# EAGLE design interstage_B1v2 (EAGLE 9.2.2)
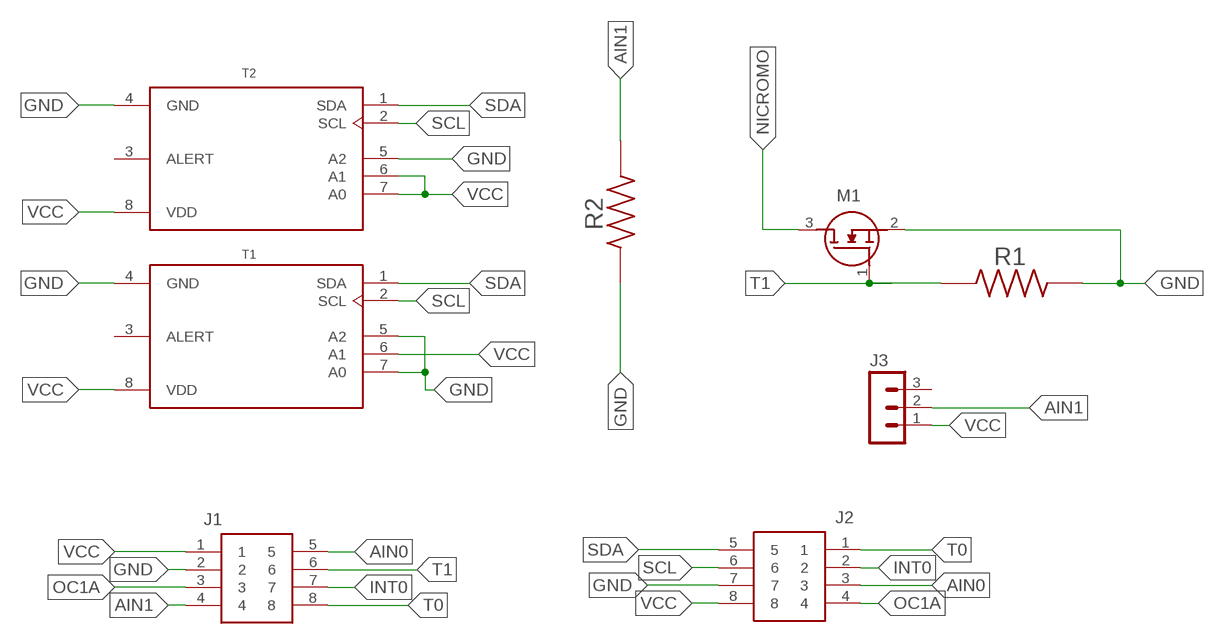
[diagram p0: schematic, sheet 1]

## Parts
J1  53261-0871  [53261-0871]
J2  53261-0871  [53261-0871]
J3  MA03-1  [MA03-1]
M1  PMV16XNR  [SOT95P230X110-3N]
R1  330  ERA-8AEB331V  [RESC3216X70N]
R2  330  ERA-8AEB331V  [RESC3216X70N]
T1  MCP9808T-E/MS  [SOP65P490X110-8N]
T2  MCP9808T-E/MS  [SOP65P490X110-8N]

## Nets
AIN0: J1.5 J2.3
AIN1: J1.4 J3.2 R2.2
GND: J1.2 J2.7 M1.2(S) R1.2 R2.1 T1.4(GND) T1.5(A2) T1.7(A0) T2.4(GND) T2.5(A2)
INT0: J1.7 J2.2
NICROMO: M1.3(D)
OC1A: J1.3 J2.4
SCL: J2.6 T1.2(SCL) T2.2(SCL)
SDA: J2.5 T1.1(SDA) T2.1(SDA)
T0: J1.8 J2.1
T1: J1.6 M1.1(G) R1.1
VCC: J1.1 J2.8 J3.1 T1.6(A1) T1.8(VDD) T2.6(A1) T2.7(A0) T2.8(VDD)
Unconnected: J3.3 T1.3(ALERT) T2.3(ALERT)

## Library data of the parts
J1 J2 = SamacSys_Parts:53261-0871: Molex PICOBLADE Series, Series Number 53261, 1.25mm Pitch, 8 Way 1 Row Shrouded Right Angle PCB Header, Surface Mount Source: Datasheet <http://www.molex.com/webdocs/datasheets/pdf/en-us/0532610871_PCB_HEADERS.pdf>; DESCRIPTION: Molex PICOBLADE Series, Series Number 53261, 1.25mm Pitch, 8 Way 1 Row Shrouded Right Angle PCB Header, Surface Mount; HEIGHT: mm; MANUFACTURER_NAME: Molex; MANUFACTURER_PART_NUMBER: 53261-0871; MOUSER_PART_NUMBER: 538-53261-0871; MOUSER_PRICE-STOCK: https://www.mouser.co.uk/ProductDetail/Molex/53261-0871?qs=%252B72YyncTwW%252BggfdCJ7Netw%3D%3D
J3 = con-lstb:MA03-1: PIN HEADER; OC_FARNELL: unknown; OC_NEWARK: unknown
M1 = SamacSys_Parts:PMV16XNR: Nexperia PMV16XNR N-channel MOSFET, 8.6 A, 20 V PMV16XN, 3-Pin SOT-23 Source: Datasheet <https://componentsearchengine.com/Datasheets/1/PMV16XNR.pdf>; DESCRIPTION: Nexperia PMV16XNR N-channel MOSFET, 8.6 A, 20 V PMV16XN, 3-Pin SOT-23; HEIGHT: 1.1mm; MANUFACTURER_NAME: Nexperia; MANUFACTURER_PART_NUMBER: PMV16XNR; MOUSER_PART_NUMBER: 771-PMV16XNR; MOUSER_PRICE-STOCK: https://www.mouser.com/Search/Refine.aspx?Keyword=771-PMV16XNR
R1 R2 = resistor_330_smd:ERA-8AEB331V; DESCRIPTION: 330 Ohms ±0.1% 0.25W, 1/4W Chip Resistor 1206 (3216 Metric) Automotive AEC-Q200 Thin Film; DIGI-KEY_PART_NUMBER: P330BCCT-ND; MF: Panasonic Electronic; MP: ERA-8AEB331V; PACKAGE: 3216 Panasonic Electronic Components
T1 T2 = sensorSPEL:MCP9808T-E/MS: Board Mount Temperature Sensors Silicon temp sensor with I2C interface; DESCRIPTION: Temperature Sensor Digital, Local -40°C ~ 125°C 10 b 8-MSOP; DIGI-KEY_PART_NUMBER: MCP9808T-E/MSCT-ND; MF: Microchip; MP: MCP9808T-E/MS; PACKAGE: MSOP-8 Microchip

## Board
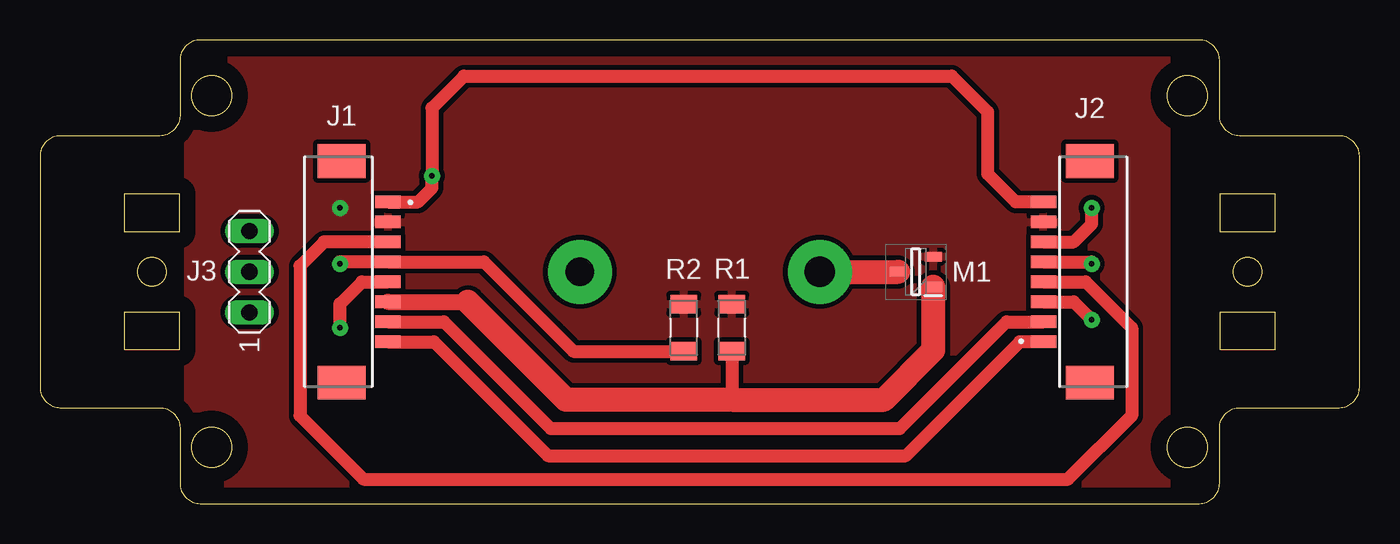
[diagram p1: board, top side]
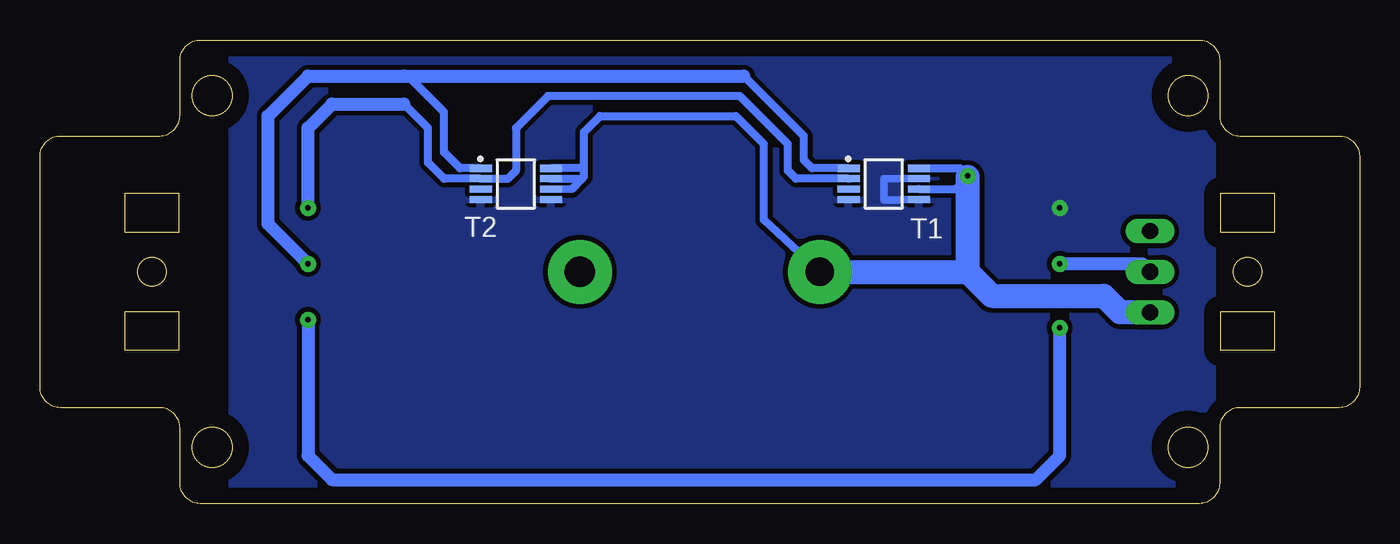
[diagram p2: board, bottom side, seen from below]

Size 82.5 x 29 mm. Coordinates in mm from the lower left corner, seen from the top.
Outline: 5.3,17 5.3,19.4 8.7,19.4 8.7,17 5.3,17
Outline: 73.8,9.6 73.8,12 77.2,12 77.2,9.6 73.8,9.6
Outline: 5.3,12 8.7,12 8.7,9.6 5.3,9.6 5.3,12
Outline: 73.8,17 73.8,19.4 77.2,19.4 77.2,17 73.8,17
Outline: 1.27,6 7.48,6 arc-90 8.75,4.73 8.75,1.27 arc90 10.02,0 72.48,0 arc90 73.75,1.27 73.75,4.73 arc-90 75.02,6 81.23,6 arc90 82.5,7.27 82.5,21.73 arc90 81.23,23 75.02,23 arc-90 73.75,24.27 73.75,27.73 arc90 72.48,29 10.02,29 arc90 8.75,27.73 8.75,24.27 arc-90 7.48,23 1.27,23 arc90 0,21.73 0,7.27 arc90 1.27,6
Outline: circle at 7,14.5 radius 0.9
Outline: circle at 75.5,14.5 radius 0.9
Outline: circle at 10.72,25.52 radius 1.25
Outline: circle at 71.72,3.52 radius 1.25
Outline: circle at 71.72,25.52 radius 1.25
Outline: circle at 10.72,3.52 radius 1.25
Copper layers (1*16): Top 0.035mm / dielectric 1.5mm / Bottom 0.035mm
Design rules "default *": minimum track width 6mil, minimum drill 0.35mm, track to track 0.3mm, track to pad 6mil, pad to pad 6mil, via to via 6mil, smd to smd 6mil, copper to edge 40mil, drill to drill 6mil, minimum pad ring 10mil, minimum via ring 8mil, stop-mask expansion 4mil, vias tented up to drill 0mil, thermal gap 10mil

### Footprints (pad centres in the part's own frame; a part is rotated, then mirrored left to right if it is on the bottom)
53261-0871 = smd 0.8 x 1.6: 1 -4.375,1.004; 2 -3.125,1.004; 3 -1.875,1.004; 4 -0.625,1.004; 5 0.625,1.004; 6 1.875,1.004; 7 3.125,1.004; 8 4.375,1.004 | smd 2.1 x 3: 9 6.925,-1.896; 10 -6.925,-1.896
MA03-1 = drill 1.016 long: 1 -2.54,0; 2 0,0; 3 2.54,0
SOT95P230X110-3N = smd 1.05 x 0.6: 1 -1.1,0.95; 2 -1.1,-0.95; 3 1.1,0
RESC3216X70N = smd 1.16 x 1.68: 1 -1.475,0; 2 1.475,0
SOP65P490X110-8N = smd 1.4 x 0.45: 1 -2.2,0.975; 2 -2.2,0.325; 3 -2.2,-0.325; 4 -2.2,-0.975; 5 2.2,-0.975; 6 2.2,-0.325; 7 2.2,0.325; 8 2.2,0.975

### Placement (x,y rotation side)
J1  20.75,14.5 270 top
J2  63.75,14.5 90 top
J3  13.1,14.5 90 top
M1  54.75,14.5 180 top
R1  43.25,11 90 top
R2  40.25,11 270 top
T1  29.75,20 0 bottom
T2  52.75,20 0 bottom

### Tracks (layer width: path | path; a pad name or v marks a point on that pad's centre or on a via)
AIN0  (via drill 0.35 pad 1)
  Top 0.8: v18.75,11 18.75,12.5 20.12,13.88 J1.5 | v65.75,11.5 64.62,12.62 J2.3
  Bottom 0.8: v65.75,11.5 65.75,3 64.25,1.5 20.25,1.5 18.75,3 v18.75,11
AIN1  (via drill 0.35 pad 1)
  Top 0.5: 18.75,15.12 v18.75,15
  Top 0.8: 18.75,15.12 J1.4 27.75,15.12 33.35,9.53 R2.2
  Bottom 0.8: v18.75,15 13.6,15 J3.2
GND  (via drill 0.35 pad 1)
  Bottom 0.47: T1.7 29.75,20.32 29.75,19 28.75,19 28.75,19.02 T1.5
  other vias: 18.75,18.5
  pour Top (isolate 0.25): 9.22,28.1 9.22,0.7 70.45,0.7 70.45,28.1
  pour Bottom (isolate 0.25): 9.25,28.1 9.25,0.7 70.45,0.7 70.45,28.1
INT0
  Top 0.8: J1.7 25.25,11.38 31.93,4.7 53.75,4.7 60.42,11.38 J2.2
NICROMO  (via drill 1.9 pad 4)
  Top 1.5: v48.75,14.5 M1.3
OC1A
  Top 0.8: J1.3 17.75,16.38 16.25,14.88 16.25,5.5 20.23,1.52 64.27,1.52 68.25,5.5 68.25,11 65.38,13.88 J2.4
SCL  (via drill 0.35 pad 1)
  Top 0.8: J2.6 64.62,16.38 65.75,17.5 v65.75,18.5
  Bottom 0.5: T1.2 35.25,20.32 35.75,20.82 35.75,22.5 38.75,25.5 50.75,25.5 52.75,23.5 52.75,20.82 53.25,20.32 T2.2 57.25,20.32 58.25,21.32 58.25,23.5 59.75,25
  Bottom 0.8: v65.75,18.5 65.75,23.5 64.25,25 59.75,25
SDA  (via drill 0.35 pad 1)
  Top 0.5: 65.75,15.12 v65.75,15
  Top 0.8: J2.5 65.75,15.12
  Bottom 0.5: T2.1 56.25,20.98 57.25,21.98 57.25,24.5 59.5,26.75 59.75,26.75 | 38.5,26.75 34.75,23 34.75,21.5 34.23,20.98 T1.1
  Bottom 0.8: 38.5,26.75 59.75,26.75 65.75,26.75 68.25,24.25 68.25,17.5 v65.75,15
T0
  Top 0.8: J2.1 61.25,10.12 54.12,3 31.75,3 24.62,10.12 J1.8
T1
  Top 0.8: R1.1 43.25,6.5
  Top 1: J1.6 26.75,12.62
  Top 1.5: 26.75,12.62 32.88,6.5 43.25,6.5 52.75,6.5 55.85,9.6 M1.1
VCC  (via drill 0.35 pad 1, 1.8 pad 4)
  Top 0.8: J2.8 61,18.88 59.25,20.62 59.25,24.5 57,26.75 26.5,26.75 24.5,24.75 v24.5,20.5 24.5,19.75 23.62,18.88 J1.1
  Bottom 0.152: 14.96,11.96 15.12,12.12
  Bottom 0.47: T2.6 49.25,19.68
  Bottom 0.5: 48.5,20.98 T2.8 | 48.5,20.98 48.5,23.25 47.5,24.25 39,24.25 37.25,22.5 37.25,17.75 v33.75,14.5 | 49.25,19.68 48.6,20.32 | 48.5,20.98 48.5,20.43 48.6,20.32 | T2.7 48.6,20.32 | T1.6 25.25,19.68 24.5,20.43 v24.5,20.5 24.98,20.98 T1.8
  Bottom 1.5: v33.75,14.5 24.5,14.5 | 15.12,12.12 16,13 23,13 24.5,14.5 | J3.1 14.96,11.96 | 24.5,14.5 24.5,20.43